# Altium project 328P Oven Controller.PrjPcb
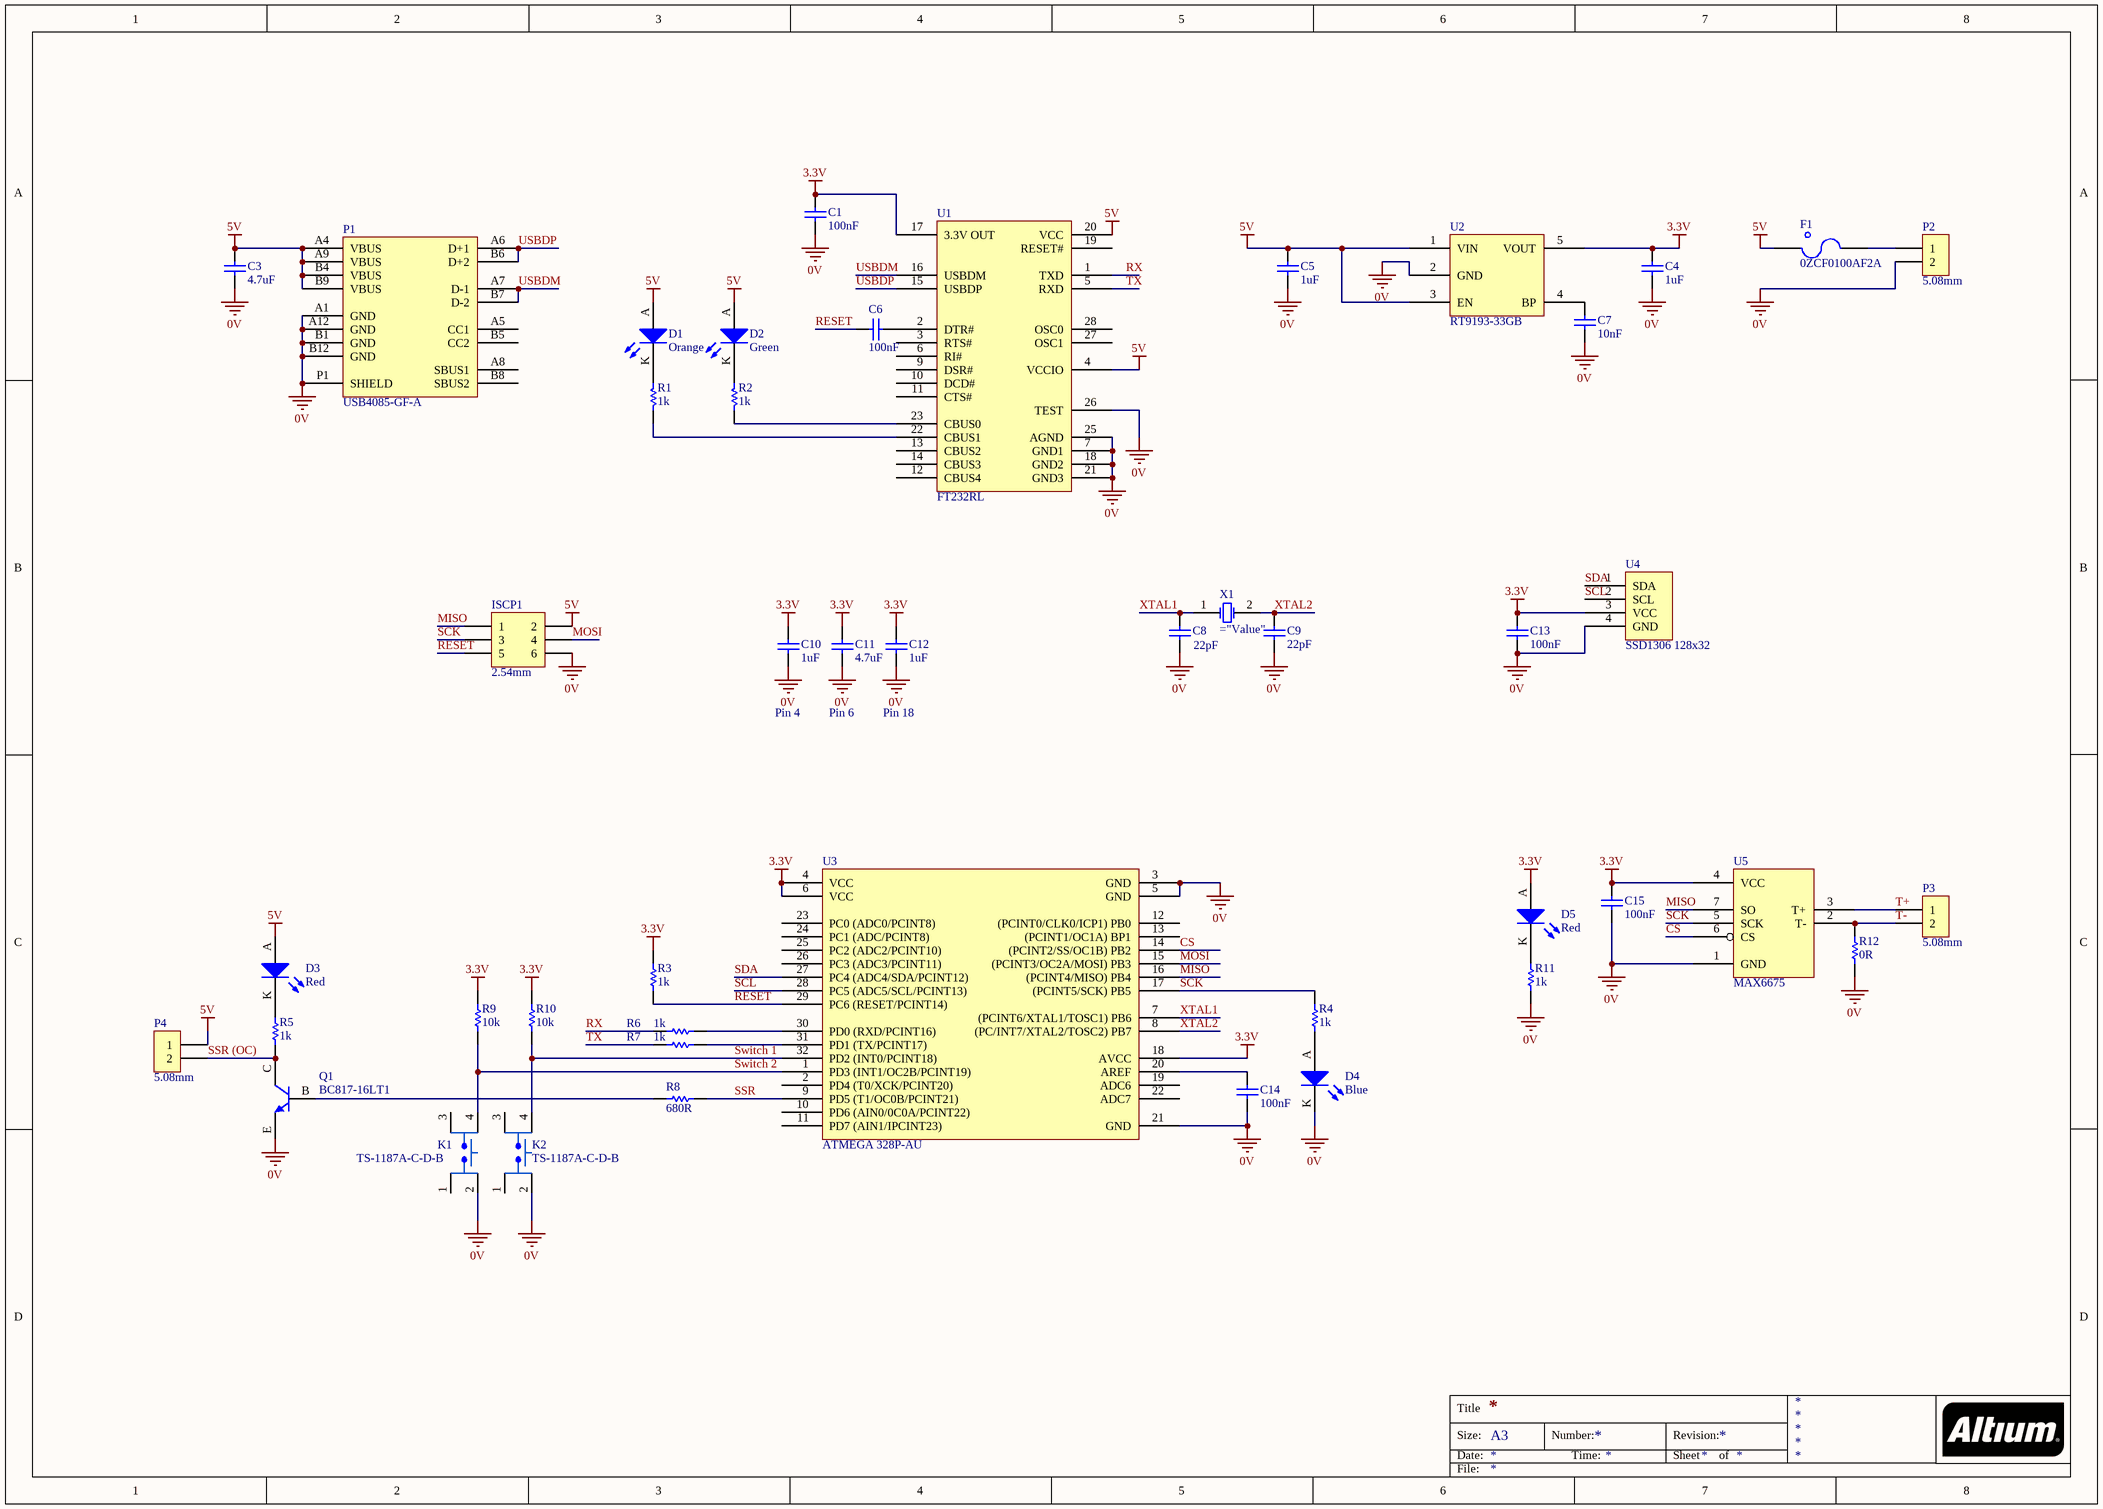
[diagram p0: Schematic.SchDoc]
1 sheet, 46 parts. Net scope: global (net labels, ports and power ports of the same name join across sheets).
Board file: PCB.PcbDoc

## Sheet Schematic.SchDoc
size A3

### Parts
C1  100nF  [0805]
C3  4.7uF  [0805]
C4  1uF  [0805]
C5  1uF  [0805]
C6  100nF  [0805]
C7  10nF  [0805]
C8  22pF  [0805]
C9  22pF  [0805]
C10  1uF  [0805]
C11  4.7uF  [0805]
C12  1uF  [0805]
C13  100nF  [0805]
C14  100nF  [0805]
C15  100nF  [0805]
D1  Orange  [0805 LED]
D2  Green  [0805 LED]
D3  Red  [0805 LED]
D4  Blue  [0805 LED]
D5  Red  [0805 LED]
F1  0ZCF0100AF2A  [2920]
ISCP1  2.54mm  [TH 2.54mm Header 2x3]
K1  TS-1187A-C-D-B  [XKB SW-4.5]
K2  TS-1187A-C-D-B  [XKB SW-4.5]
P1  USB4085-GF-A  [USB4085-GF-A]
P2  5.08mm  [TH 5.08mm Header 1x2]
P3  5.08mm  [TH 5.08mm Header 1x2]
P4  5.08mm  [TH 5.08mm Header 1x2]
Q1  BC817-16LT1  [ON SOT-23 BJT]
R1  1k  [0805]
R2  1k  [0805]
R3  1k  [0805]
R4  1k  [0805]
R5  1k  [0805]
R6  1k  [0805]
R7  1k  [0805]
R8  680R  [0805]
R9  10k  [0805]
R10  10k  [0805]
R11  1k  [0805]
R12  0R  [0805]
U1  FT232RL  [FTDI 28-SSOP]
U2  RT9193-33GB  [RICHTEK SOT-23-5]
U3  ATMEGA 328P-AU  [ATMEL TQFP-32]
U4  SSD1306 128x32  [IIC 128x32 OLED]
U5  MAX6675  [MI 8-SOIC]
X1  (no value)  [Abracon HC-49/US]

### Nets
0V: C1.2 C3.1 C4.1 C5.1 C7.1 C8.1 C9.1 C10.1 C11.1 C12.1 C13.1 C14.1 C15.1 D4.K ISCP1.6 K1.2(VDD) K2.2(VDD) P1.A1(GND) P1.A12(GND) P1.B1(GND) P1.B12(GND) P1.P1(SHIELD) P2.2 Q1.E R11.1 R12.1 U1.7(GND1) U1.18(GND2) U1.21(GND3) U1.25(AGND) U1.26(TEST) U2.2(GND) U3.3(GND) U3.5(GND) U3.21(GND) U4.4(GND) U5.1(GND)
3.3V: C1.1 C4.2 C10.2 C11.2 C12.2 C13.2 C15.2 D5.A R3.2 R9.2 R10.2 U1.17(3.3V_OUT) U2.5(VOUT) U3.4(VCC) U3.6(VCC) U3.18(AVCC) U4.3(VCC) U5.4(VCC)
5V: C3.2 C5.2 D1.A D2.A D3.A F1.2 ISCP1.2 P1.A4(VBUS) P1.A9(VBUS) P1.B4(VBUS) P1.B9(VBUS) P4.1 U1.4(VCCIO) U1.20(VCC) U2.1(VIN) U2.3(EN)
CS: U3.14((PCINT2/SS/OC1B)_PB2) U5.6(CS)
MISO: ISCP1.1 U3.16((PCINT4/MISO)_PB4) U5.7(SO)
MOSI: ISCP1.4 U3.15((PCINT3/OC2A/MOSI)_PB3)
RESET: C6.1 ISCP1.5 R3.1 U3.29(PC6_(RESET/PCINT14))
RX: R6.2 U1.1(TXD)
SCK: ISCP1.3 R4.2 U3.17((PCINT5/SCK)_PB5) U5.5(SCK)
SCL: U3.28(PC5_(ADC5/SCL/PCINT13)) U4.2(SCL)
SDA: U3.27(PC4_(ADC4/SDA/PCINT12)) U4.1(SDA)
SSR: R8.2 U3.9(PD5_(T1/OC0B/PCINT21))
SSR (OC): P4.2 Q1.C R5.1
Switch 1: K2.4(VDD) R10.1 U3.32(PD2_(INT0/PCINT18))
Switch 2: K1.4(VDD) R9.1 U3.1(PD3_(INT1/OC2B/PCINT19))
T+: P3.1 U5.3(T+)
T-: P3.2 R12.2 U5.2(T-)
TX: R7.2 U1.5(RXD)
USBDM: P1.A7(D-1) P1.B7(D-2) U1.16(USBDM)
USBDP: P1.A6(D+1) P1.B6(D+2) U1.15(USBDP)
XTAL1: C8.2 U3.7((PCINT6/XTAL1/TOSC1)_PB6) X1.1(OSC1)
XTAL2: C9.2 U3.8((PC/INT7/XTAL2/TOSC2)_PB7) X1.2(OSC2)
NetC6_2: C6.2 U1.2(DTR#)
NetC7_2: C7.2 U2.4(BP)
NetC14_2: C14.2 U3.20(AREF)
NetD1_K: D1.K R1.1
NetD2_K: D2.K R2.1
NetD3_K: D3.K R5.2
NetD4_A: D4.A R4.1
NetD5_K: D5.K R11.2
NetF1_1: F1.1 P2.1
NetQ1_B: Q1.B R8.1
NetR1_2: R1.2 U1.22(CBUS1)
NetR2_2: R2.2 U1.23(CBUS0)
NetR6_1: R6.1 U3.30(PD0_(RXD/PCINT16))
NetR7_1: R7.1 U3.31(PD1_(TX/PCINT17))

Not connected (* = marked no-connect by the designer): K1 1(VDD) 3(VDD); K2 1(VDD) 3(VDD); P1 A5(CC1) A8(SBUS1) B5(CC2) B8(SBUS2); U1 3(RTS#) 6(RI#) 9(DSR#) 10(DCD#) 11(CTS#) 12(CBUS4) 13(CBUS2) 14(CBUS3) 19(RESET#) 27(OSC1) 28(OSC0); U3 2(PD4_(T0/XCK/PCINT20)) 10(PD6_(AIN0/0C0A/PCINT22)) 11(PD7_(AIN1/IPCINT23)) 12((PCINT0/CLK0/ICP1)_PB0) 13((PCINT1/OC1A)_BP1) 19(ADC6) 22(ADC7) 23(PC0_(ADC0/PCINT8)) 24(PC1_(ADC/PCINT8)) 25(PC2_(ADC2/PCINT10)) 26(PC3_(ADC3/PCINT11))

### Notes on the sheet
- Pin 4
- Pin 6
- Pin 18
- Title
- Size:
- Date:
- A3
- Number:
- Time:
- Revision:
- Sheet
- of
- File:

### Library data of the parts
C1 C6 C13-C15 = GCM21BR71H104KA37L: Manufacturer: muRata; Tolerance: ±10%; Material: X7R; Rated Voltage: 50V; Part Number: GCM21BR71H104KA37L; Value: 100nF; Digikey Part Number: 490-6064-1-ND
C3 C11 = GCM21BR61A475KA37L: Manufacturer: muRata; Tolerance: 10%; Material: X5R; Rated Voltage: 10V; Part Number: GCM21BR61A475KA37L; Value: 4.7uF; Digikey Part Number: DO NOT USE FOR NEW DESIGNS
C4 C5 C10 C12 = AC0805KKX7R8BB105: Manufacturer: YAGEO; Tolerance: 10%; Material: X7R; Rated Voltage: 25V; Part Number: AC0805KKX7R8BB105; Value: 1uF; Digikey Part Number: DO NOT USE FOR NEW DESIGNS
C7 = GCM2195C1H103JA16D: Manufacturer: muRata; Tolerance: ±5%; Material: C0G, NP0; Rated Voltage: 50V; Part Number: GCM2195C1H103JA16D; Value: 10nF; Digikey Part Number: 490-4783-1-ND
C8 C9 = GRM21A5C2E220JW01D: Manufacturer: muRata; Tolerance: ±5%; Material: C0G, NP0; Rated Voltage: 250V; Part Number: GRM21A5C2E220JW01D; Value: 22pF; Digikey Part Number: 490-5534-1-ND
D1 = SML-211DTT86: Orange LED Indication - Discrete 1.75V 0805 (2012 Metric); Manufacturer: ROHM Semiconductor; Part Number: SML-211DTT86; Colour: Orange; Digikey Part Number: 511-1291-1-ND; Digikey Link: https://www.digikey.com/product-detail/en/rohm-semiconductor/SML-211DTT86/511-1291-1-ND/637104
D2 = SML-210FTT86: Green LED Indication - Discrete 1.75V 0805 (2012 Metric); Manufacturer: ROHM Semiconductor; Part Number: SML-210FTT86; Colour: Green; Digikey Part Number: 511-1285-1-ND; Digikey Link: https://www.digikey.com/product-detail/en/rohm-semiconductor/SML-210FTT86/511-1285-1-ND/637098
D3 D5 = SML-210LTT86: Red LED Indication - Discrete 1.75V 0805 (2012 Metric); Manufacturer: ROHM Semiconductor; Part Number: SML-210LTT86; Colour: Red; Digikey Part Number: 511-1286-1-ND; Digikey Link: https://www.digikey.com/product-detail/en/rohm-semiconductor/SML-210LTT86/511-1286-1-ND/637099
D4 = SML-MN2BCTT86C: LED BLUE CLEAR 2012 SMD; Manufacturer: ROHM Semiconductor; Part Number: SML-MN2BCTT86C; Colour: Blue; Digikey Part Number: 846-1207-1-ND; Digikey Link: https://www.digikey.com/product-detail/en/rohm-semiconductor/SMLMN2BCTT86C/846-1207-1-ND/6057239
F1 = 0ZCF0100AF2A: PTC RESET FUSE 60V 1A 292; Manufacturer: Littelfuse Inc.; Part Number: 0ZCF0100AF2A; Digikey Part Number: 507-2070-1-ND; Digikey Link: https://www.digikey.com/product-detail/en/bel-fuse-inc/0ZCF0100AF2A/507-2070-1-ND/6210547
ISCP1 = TH 2.54mm Header 2x3: Positions: 6; Angle: 0; Flange: No; Contact: NA; Part Number: TH 2.54mm Header 2x3; Pitch: 2.54mm; Row Spacing: 2.54mm
K1 K2 = TS-1187A-C-D-B: TACTILE SWITCHES SPST 5.10MM X 5.10MM 0.80MM SMD ROHS; Manufacturer: XKB Enerprise; Part Number: TS-1187A-C-D-B; Link: https://jlcpcb.com/client/index.html#/parts/componentSearch?searchTxt=usb
P1 = USB4085-GF-A: USB - C (Type - C) USB 2.0 Receptacle Connector 16 Position Through Hole, Right Angle; Angle: 90; Part Number: USB4085-GF-A; Digikey Part Number: 2073-USB4085-GF-ACT-ND; Digikey Link: https://www.digikey.ee/product-detail/en/gct/USB4085-GF-A/2073-USB4085-GF-ACT-ND/9859733
P2-P4 = 1760510000: Positions: 2; Row Spacing: 0; Flange: No; Contact: NA; Part Number: 1760510000; Pitch: 5.08mm; Angle: 0; Digikey Part Number: 281-1882-ND; Digikey Link: https://www.digikey.com.au/product-detail/en/weidm%C3%BCller/1760510000/281-1882-ND/459739
Q1 = BC817-16LT1: 300mW  BJT NPN Transistor; Manufacturer: ON Semiconductor; Part Number: BC817-16LT1; Digikey Part Number: BC817-16LT1OSTR-ND; Digikey Link: https://www.digikey.com.au/product-detail/en/on-semiconductor/BC817-16LT1/BC817-16LT1OSTR-ND/606178
R1-R7 R11 = RC0805FR071KL: Manufacturer: YAGEO; Tolerance: 0.01; Rated Voltage: 0.125W; Part Number: RC0805FR071KL; Value: 1k; Material: FR-07; Digikey Part Number: 311-1.00KCRCT-ND
R8 = RC0805FR07680RL: Manufacturer: YAGEO; Tolerance: 0.01; Rated Voltage: 0.125W; Part Number: RC0805FR07680RL; Value: 680R; Material: FR-07; Digikey Part Number: 311-680CRCT-ND
R9 R10 = RC0805FR0710KL: Manufacturer: YAGEO; Tolerance: 0.01; Rated Voltage: 0.125W; Part Number: RC0805FR0710KL; Value: 10k; Material: FR-07; Digikey Part Number: 311-10.0KCRCT-ND
R12 = RC0805FR070RL: Manufacturer: YAGEO; Tolerance: 0.01; Rated Voltage: 0.125W; Part Number: RC0805FR070RL; Value: 0R; Material: FR-07; Digikey Part Number: 311-0.0CRCT-ND
U1 = FT232RL: USB Bridge, USB to UART USB 2.0 UART Interface 28-SSOP; Manufacturer: FTDI; Part Number: FT232RL; Digikey Part Number: 768-1007-1-ND; Digikey Link: https://www.digikey.com/product-detail/en/ftdi-future-technology-devices-international-ltd/FT232RL-REEL/768-1007-1-ND/1836402
U2 = RT9193-33GB: IC REG LINEAR 3.3V 300MA SOT23-5; Manufacturer: Richtek; Part Number: RT9193-33GB; Digikey Part Number: 1028-1014-1-ND; Digikey Link: https://www.digikey.com/products/en?keywords=1028-1014-1-ND
U3 = ATMEGA 328P-AU: AVR AVR® ATmega Microcontroller IC 8-Bit 20MHz 32KB (16K x 16) FLASH 32-TQFP (7x7); Manufacturer: ATMEL; Part Number: ATMEGA 328P-AU; Digikey Part Number: ATMEGA328P-AU-ND; Digikey Link: https://www.digikey.com/product-detail/en/microchip-technology/ATMEGA328P-AU/ATMEGA328P-AU-ND/1832260
U4 = SSD1306 128x32: AU 0.91" IIC I2C OLED LCD Display Module 128x32 for Arduino PIC SSD1306 3.3V~5V; Part Number: SSD1306 128x32; Manufacturer: IIC
U5 = MAX6675: IC THERMOCOUP TO DGTL 8-SOIC; Manufacturer: Maxim Integrated; Part Number: MAX6675; Digikey Part Number: MAX6675ISA+-ND; Digikey Link: https://www.digikey.com/product-detail/en/maxim-integrated/MAX6675ISA/MAX6675ISA-ND/1513517
X1 = ABLS-16.000MHZ-B4-T: Manufacturer: Abracon LLC; Load Capacitance: 18pF; ESR: 40R; Part Number: ABLS-16.000MHZ-B4-T; Digikey Part Number: 535-10226-1-ND; Digikey Link: https://www.digikey.com/product-detail/en/abracon-llc/ABLS-16.000MHZ-B4-T/535-10226-1-ND/2184261